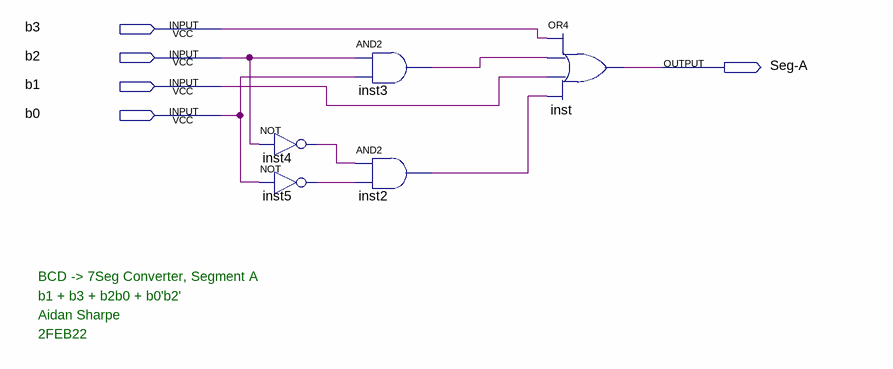
[diagram p0: schematic sheet]
// Quartus schematic BCD_7Seg_A.bdf as structural Verilog: 5 symbols, 5 pins
module BCD_7Seg_A (
  input  b3,
  input  b2,
  input  b1,
  input  b0,
  output \Seg-A 
);

  wire inst2_out, inst3_out, inst4_out, inst5_out;

  not inst4 (inst4_out, b2);
  not inst5 (inst5_out, b0);
  and inst3 (inst3_out, b2, b0);
  and inst2 (inst2_out, inst4_out, inst5_out);
  or inst (\Seg-A , b3, inst3_out, b1, inst2_out);

  // Notes on the sheet:
  //   BCD -> 7Seg Converter, Segment A
  //   b1 + b3 + b2b0 + b0'b2'
  //   Aidan Sharpe
  //   2FEB22
endmodule
